# EAGLE design dustmap_lora (EAGLE 8.7.1)
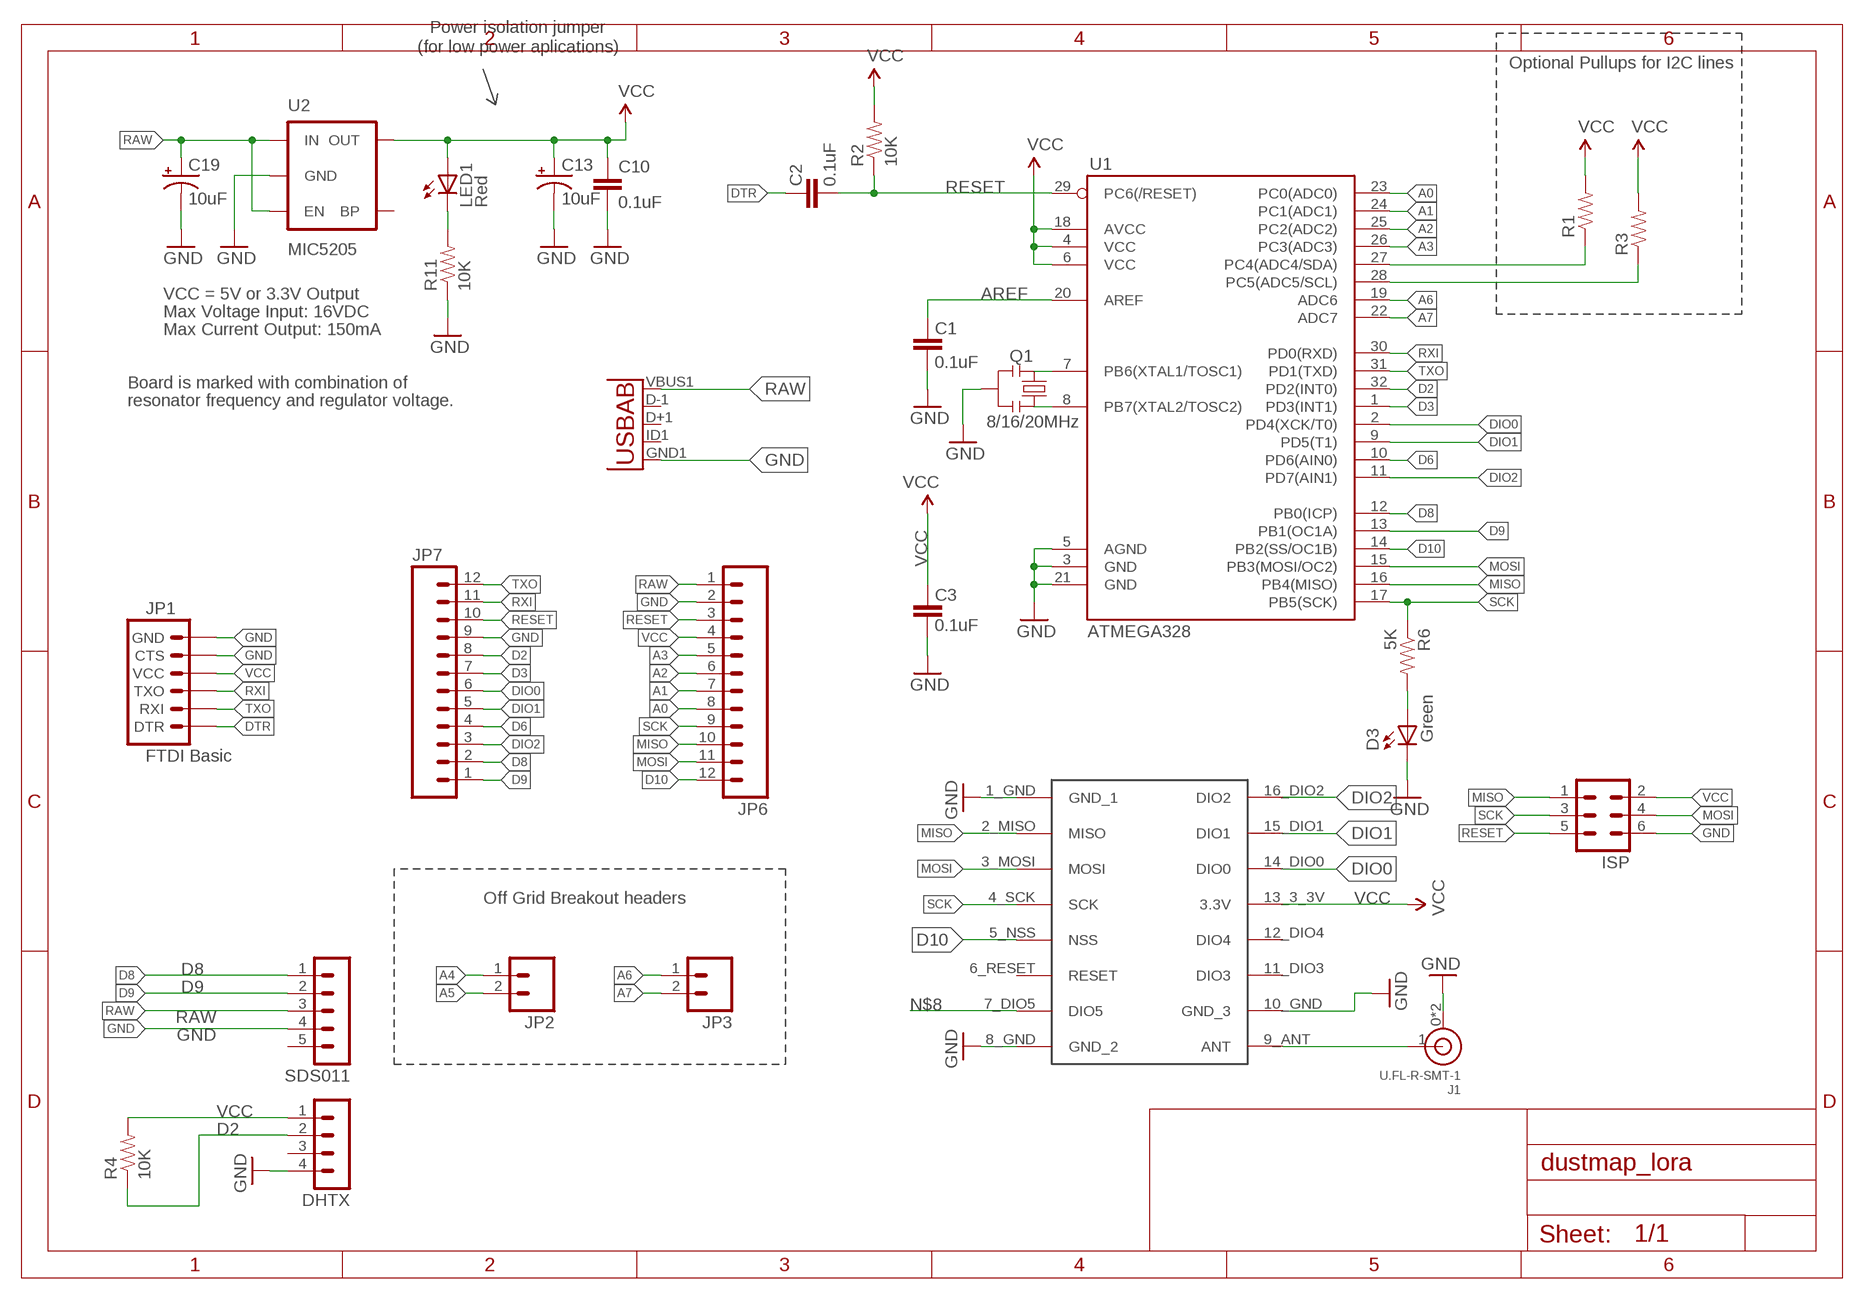
[diagram p0: schematic, sheet 1]

## Parts
C1  0.1uF  CAP0603-CAP  [0603-CAP]
C2  0.1uF  CAP0603-CAP  [0603-CAP]
C3  0.1uF  CAP0603-CAP  [0603-CAP]
C10  0.1uF  CAP0603-CAP  [0603-CAP]
C13  10uF  CAP_POL1206  [EIA3216]
C19  10uF  CAP_POL1206  [EIA3216]
D3  Green  LED  [0603-LED-ALT1]
DHTX  MA04-1  [MA04-1]
ISP  MA03-2  [MA03-2]
J1  U.FL-R-SMT-1  [U.FL]
JP1  FTDI Basic  ARDUINO_SERIAL_PROGRAMPTH  [1X06]
JP2  M02PTH  [1X02]
JP3  M02PTH  [1X02]
JP6  M12PTH  [1X12]
JP7  M12PTH  [1X12]
LED1  Red  LED  [0603-LED-ALT1]
Q1  8/16/20MHz  RESONATOR1:1  [RESONATOR-SMD-1:1]
R1  RESISTOR0603-RES  [0603-RES]
R2  10K  RESISTOR0603-RES  [0603-RES]
R3  RESISTOR0603-RES  [0603-RES]
R4  10K  RESISTOR0603-RES  [0603-RES]
R6  5K  RESISTOR0603-RES  [0603-RES]
R11  10K  RESISTOR0603-RES  [0603-RES]
SDS011  MA05-1  [MA05-1]
U1  ATMEGA328  ATMEGA168  [TQFP32-08]
U2  MIC5205  V_REG_LDOSMD  [SOT23-5]
U3  USB""  [USB-MICRO-SMD]
U$1  RF96  [SMD]

## Nets
A0: JP6.8 U1.23(PC0(ADC0))
A1: JP6.7 U1.24(PC1(ADC1))
A2: JP6.6 U1.25(PC2(ADC2))
A3: JP6.5 U1.26(PC3(ADC3))
A4: JP2.1 R1.1 U1.27(PC4(ADC4/SDA))
A5: JP2.2 R3.1 U1.28(PC5(ADC5/SCL))
A6: JP3.1 U1.19(ADC6)
A7: JP3.2 U1.22(ADC7)
AREF: C1.2 U1.20(AREF)
D2: DHTX.2 JP7.8 R4.1 U1.32(PD2(INT0))
D3: JP7.7 U1.1(PD3(INT1))
D6: JP7.4 U1.10(PD6(AIN0))
D8: JP7.2 SDS011.1 U1.12(PB0(ICP))
D9: JP7.1 SDS011.2 U1.13(PB1(OC1A))
D10: JP6.12 U1.14(PB2(SS/OC1B)) U$1.5_NSS(NSS)
DIO0: JP7.6 U1.2(PD4(XCK/T0)) U$1.14_DIO0(DIO0)
DIO1: JP7.5 U1.9(PD5(T1)) U$1.15_DIO1(DIO1)
DIO2: JP7.3 U1.11(PD7(AIN1)) U$1.16_DIO2(DIO2)
DTR: C2.2 JP1.1(DTR)
GND [vcc]: C1.1 C3.1 C10.2 C13.C(-) C19.C(-) D3.C DHTX.4 ISP.6 J1.0(GND) J1.2(GND) JP1.5(CTS) JP1.6(GND) JP6.2 JP7.9 Q1.2 R11.1 SDS011.4 U1.3(GND) U1.5(AGND) U1.21(GND) U2.2(GND) U3.GND1(GND) U$1.1_GND(GND_1) U$1.8_GND(GND_2) U$1.10_GND(GND_3)
MISO: ISP.1 JP6.10 U1.16(PB4(MISO)) U$1.2_MISO(MISO)
MOSI: ISP.4 JP6.11 U1.15(PB3(MOSI/OC2)) U$1.3_MOSI(MOSI)
N$1: Q1.3 U1.8(PB7(XTAL2/TOSC2))
N$2: Q1.1 U1.7(PB6(XTAL1/TOSC1))
N$3: J1.1(SIG) U$1.9_ANT(ANT)
N$4: LED1.C R11.2
N$7: D3.A R6.2
N$8: U$1.7_DIO5(DIO5)
RAW [vcc]: C19.A(+) JP6.1 SDS011.3 U2.1(IN) U2.3(EN) U3.VBUS1(VBUS)
RESET: C2.1 ISP.5 JP6.3 JP7.10 R2.1 U1.29(PC6(/RESET))
RXI: JP1.3(TXO) JP7.11 U1.30(PD0(RXD))
SCK: ISP.3 JP6.9 R6.1 U1.17(PB5(SCK)) U$1.4_SCK(SCK)
TXO: JP1.2(RXI) JP7.12 U1.31(PD1(TXD))
VCC: C3.2 C10.1 C13.A(+) DHTX.1 ISP.2 JP1.4(VCC) JP6.4 LED1.A R1.2 R2.2 R3.2 R4.2 U1.4(VCC) U1.6(VCC) U1.18(AVCC) U2.5(OUT) U$1.13_3_3V(3.3V)
Unconnected: DHTX.3 SDS011.5 U2.4(BP) U3.D+1(D+) U3.D-1(D-) U3.ID1(USBID) U$1.6_RESET(RESET) U$1.11_DIO3(DIO3) U$1.12_DIO4(DIO4)

## Notes on the sheet
- Power isolation jumper
- (for low power aplications)
- Optional Pullups for I2C lines
- VCC = 5V or 3.3V Output
- Max Voltage Input: 16VDC
- Max Current Output: 150mA
- Board is marked with combination of
- resonator frequency and regulator voltage.
- Off Grid Breakout headers

## Library data of the parts
C1-C3 C10 = SparkFun:CAP: Capacitor Standard 0603 ceramic capacitor, and 0.1" leaded capacitor.
C13 C19 = SparkFun:CAP_POL: Capacitor Polarized These are standard SMD and PTH capacitors. Normally 10uF, 47uF, and 100uF in electrolytic and tantalum varieties. Always verify the external diameter of the through hole cap, it varies with capacity, voltage, and manufacturer. The EIA devices should be standard.
D3 LED1 = Testing:LED: LEDs Standard schematic elements and footprints for 5mm, 3mm, 1206, and 0603 sized LEDs. 5mm - Spark Fun Electronics SKU : COM-00529 (and others)
DHTX = con-lstb:MA04-1: PIN HEADER; OC_FARNELL: unknown; OC_NEWARK: unknown
ISP = con-lstb:MA03-2: PIN HEADER; OC_FARNELL: unknown; OC_NEWARK: unknown
J1 = J:U.FL-R-SMT-1: U.FL SMD antenna connector Source: https://www.hirose-connectors.com/connectors/H204ProductListSearch.aspx?sn=U.FL&cat=03
JP1 = SparkFun:ARDUINO_SERIAL_PROGRAM
JP2 JP3 = SparkFun:M02: Header 2 Standard 2-pin 0.1" header. Use with straight break away headers (SKU : PRT-00116), right angle break away headers (PRT-00553), swiss pins (PRT-00743), machine pins (PRT-00117), and female headers (PRT-00115). Molex polarized connector foot print use with SKU : PRT-08233 with associated crimp pins and housings.
JP6 JP7 = SparkFun:M12: Header 12 Standard 12-pin 0.1" header. Use with straight break away headers (SKU : PRT-00116), right angle break away headers (PRT-00553), swiss pins (PRT-00743), machine pins (PRT-00117), and female headers (PRT-00115).
Q1 = Testing:RESONATOR: Resonator Small SMD resonator. This is the itty bitty 10/20MHz resonators with built in caps. CSTCE10M0G55 and CSTCE20M0V53. Footprint for SMD has been used in SFE production for years, and does work okay. 1:1 is an attempt to get larger fillets on the sides so it will be easier to inspect these solders in our AOI machine. The pads have been minimized to match the actual metal under the resonator. To see this relation, it includes an image import of the bottom side of the component. Imported to scale on layer 200.
R1-R4 R6 R11 = SparkFun:RESISTOR: Resistor Basic schematic elements and footprints for 0603, 1206, and PTH resistors.
SDS011 = con-lstb:MA05-1: PIN HEADER; OC_FARNELL: unknown; OC_NEWARK: unknown
U1 = SparkFun:ATMEGA168
U2 = SparkFun:V_REG_LDO: Voltage Regulator LDO Standard 150mA LDO voltage regulator in SOT-23 layout. Micrel part MIC5205. BP (by-pass) pin is used to lower output noise with 470pF cap.
U3 = MicroUSB:USB: This is a USB AB connector that is compatible with USB OTG. i.e. this connector can serve as a host or device
U$1 = dustmap:RF96

## Net classes
0 default: width 0.203 mm
1 vcc: width 0.254 mm

## Board
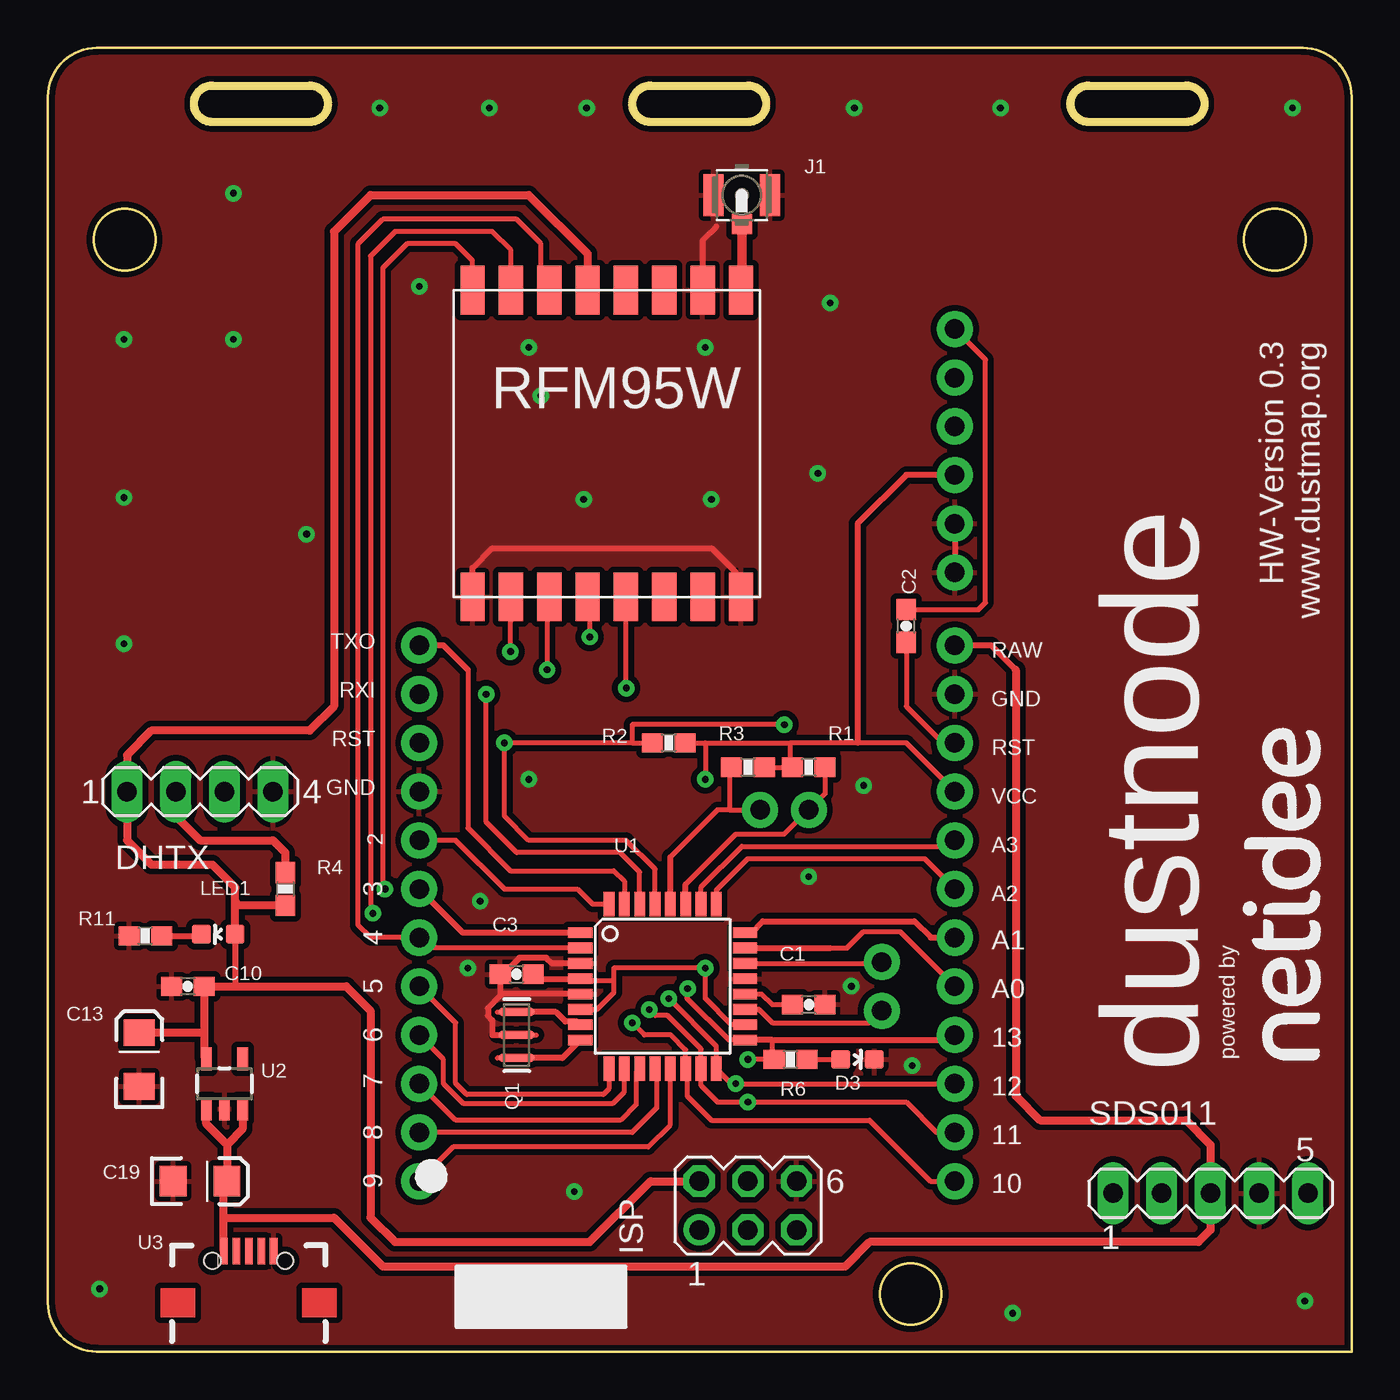
[diagram p1: board, top side]
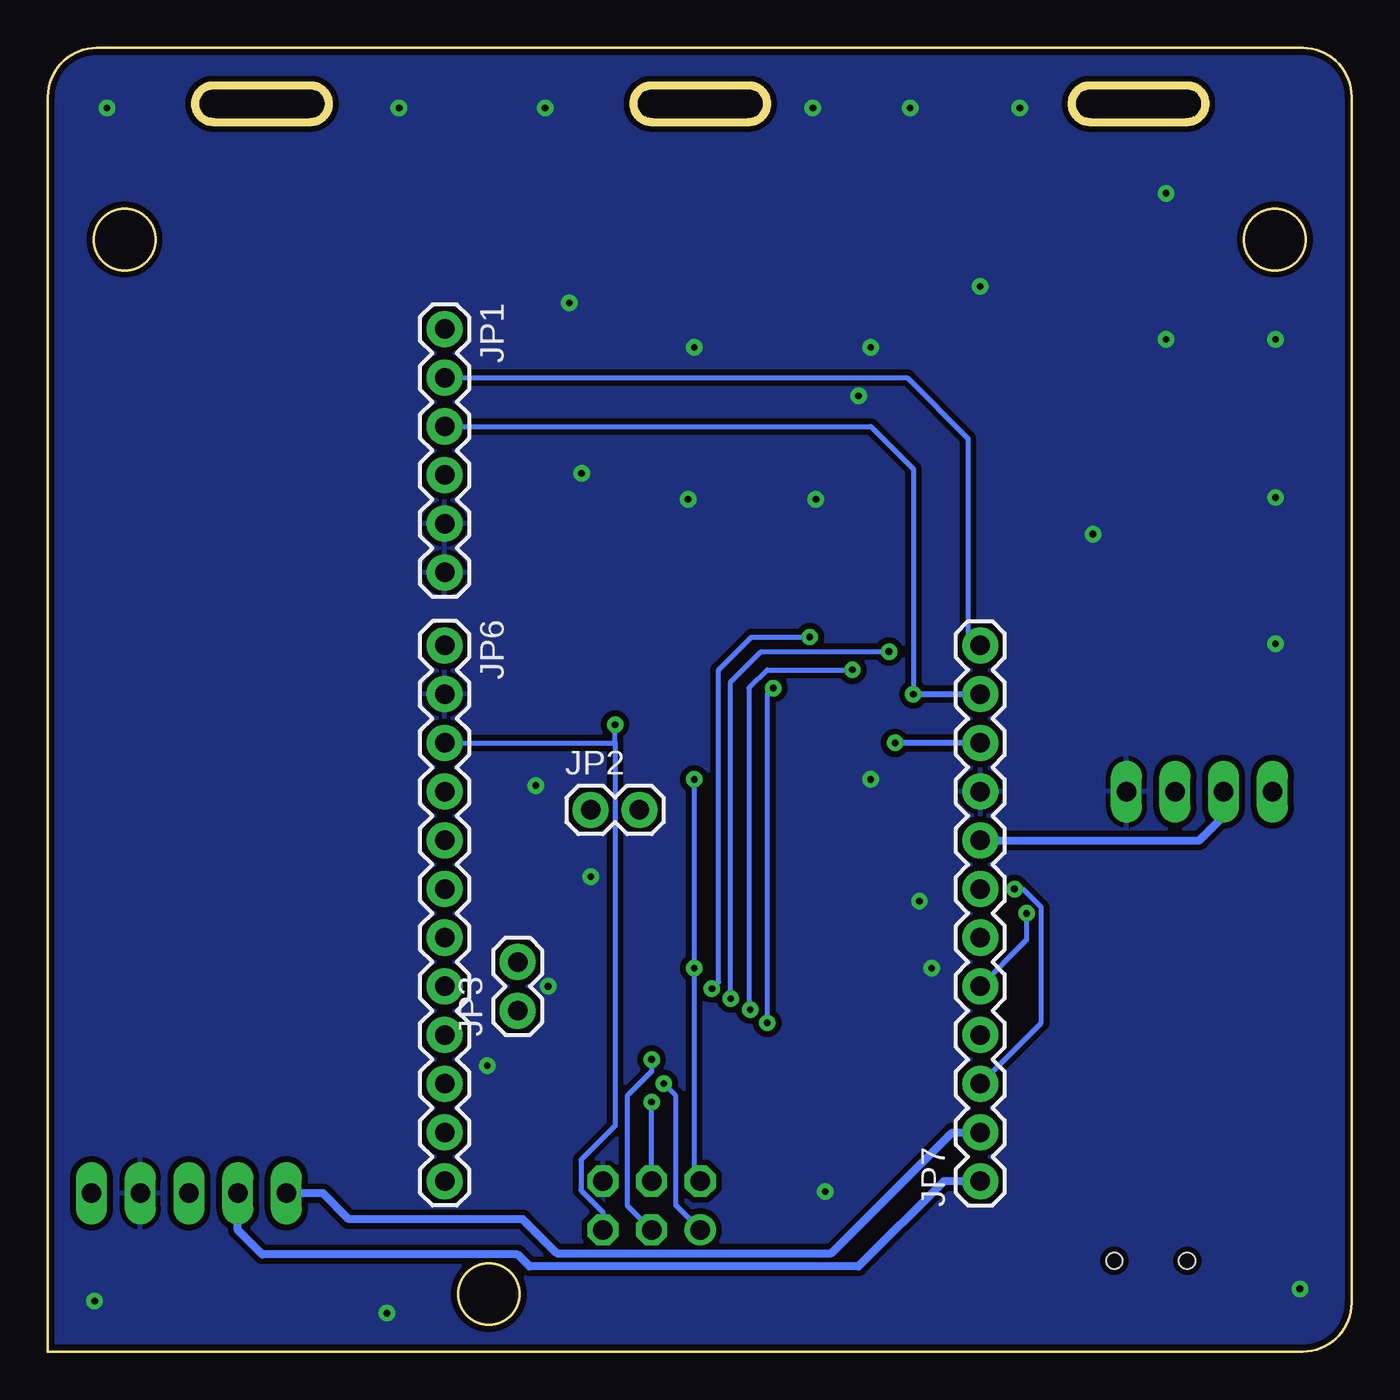
[diagram p2: board, bottom side, seen from below]

Size 68 x 68 mm. Coordinates in mm from the lower left corner, seen from the top.
Outline: 8.57,66.04 13.65,66.04 arc-180 13.65,64.14 8.57,64.14 arc-180 8.57,66.04
Outline: 54.29,66.04 59.37,66.04 arc-180 59.37,64.14 54.29,64.14 arc-180 54.29,66.04
Outline: 31.43,66.04 36.51,66.04 arc-180 36.51,64.14 31.43,64.14 arc-180 31.43,66.04
Copper layers (1*16): Top 0.035mm / dielectric 1.5mm / Bottom 0.035mm
Design rules "SparkFun-2-layer *": minimum track width 7mil, minimum drill 15mil, track to track 8mil, track to pad 8mil, pad to pad 8mil, via to via 8mil, smd to smd 8mil, copper to edge 8mil, drill to drill 8mil, minimum pad ring 12mil, minimum via ring 10mil, stop-mask expansion 4mil, vias tented up to drill 20mil, thermal gap 10mil

### Footprints (pad centres in the part's own frame; a part is rotated, then mirrored left to right if it is on the bottom)
0603-CAP = smd 1.1 x 1: 1 -0.85,0; 2 0.85,0
EIA3216 = smd 1.4 x 1.6: A 1.4,0; C -1.4,0
0603-LED-ALT1 = smd 1 x 1: A 0,-0.877; C 0,0.877
MA04-1 = drill 1.016 long: 1 -3.81,0; 2 -1.27,0; 3 1.27,0; 4 3.81,0
MA03-2 = drill 1.016: 1 -2.54,-1.27 | drill 1.016 octagon: 2 -2.54,1.27; 3 0,-1.27; 4 0,1.27; 5 2.54,-1.27; 6 2.54,1.27
U.FL = smd 1.05 x 2.2: 0 -1.475,0; 2 1.475,0 | smd 1.05 x 1.05: 1 0,-1.525
1X06 = drill 1.016 pad 1.88: 1 0,0; 2 2.54,0; 3 5.08,0; 4 7.62,0; 5 10.16,0; 6 12.7,0
1X02 = drill 1.016 pad 1.88: 1 0,0; 2 2.54,0
1X12 = drill 1.016 pad 1.88: 1 0,0; 2 2.54,0; 3 5.08,0; 4 7.62,0; 5 10.16,0; 6 12.7,0; 7 15.24,0; 8 17.78,0; 9 20.32,0; 10 22.86,0; 11 25.4,0; 12 27.94,0
RESONATOR-SMD-1:1 = smd 0.45 x 1.905: 1 -1.2,0; 2 0,0; 3 1.2,0
0603-RES = smd 1.1 x 1: 1 -0.85,0; 2 0.85,0
MA05-1 = drill 1.016 long: 1 -5.08,0; 2 -2.54,0; 3 0,0; 4 2.54,0; 5 5.08,0
TQFP32-08 = smd 1.27 x 0.559: 1 -4.293,2.8; 2 -4.293,2; 3 -4.293,1.2; 4 -4.293,0.4; 5 -4.293,-0.4; 6 -4.293,-1.2; 7 -4.293,-2; 8 -4.293,-2.8; 17 4.293,-2.8; 18 4.293,-2; 19 4.293,-1.2; 20 4.293,-0.4; 21 4.293,0.4; 22 4.293,1.2; 23 4.293,2; 24 4.293,2.8 | smd 0.559 x 1.27: 9 -2.8,-4.293; 10 -2,-4.293; 11 -1.2,-4.293; 12 -0.4,-4.293; 13 0.4,-4.293; 14 1.2,-4.293; 15 2,-4.293; 16 2.8,-4.293; 25 2.8,4.293; 26 2,4.293; 27 1.2,4.293; 28 0.4,4.293; 29 -0.4,4.293; 30 -1.2,4.293; 31 -2,4.293; 32 -2.8,4.293
SOT23-5 = smd 0.55 x 1.2: 1 -0.95,-1.3; 2 0,-1.3; 3 0.95,-1.3; 4 0.95,1.3; 5 -0.95,1.3
USB-MICRO-SMD = smd 1.4 x 0.4: D+1 2.7,0; D-1 2.7,0.65; GND1 2.7,-1.3; ID1 2.7,-0.65; VBUS1 2.7,1.3 | hole 0.85: 2.2,1.9; 2.2,-1.9
SMD = smd 2.54 x 1.27: 1_GND 0,15; 2_MISO 0,13; 3_MOSI 0,11; 4_SCK 0,9; 5_NSS 0,7; 6_RESET 0,5; 7_DIO5 0,3; 8_GND 0,1; 9_ANT 16,1; 10_GND 16,3; 11_DIO3 16,5; 12_DIO4 16,7; 13_3_3V 16,9; 14_DIO0 16,11; 15_DIO1 16,13; 16_DIO2 16,15

### Placement (x,y rotation side)
C1  39.69,18.1 180 top
C2  44.77,37.85 90 top
C3  24.45,19.68 0 top
C10  7.3,19.05 180 top
C13  4.76,15.24 90 top
C19  7.94,8.89 0 top
D3  42.23,15.24 270 top
DHTX  7.94,29.21 0 top
ISP  36.51,7.62 0 top
J1  36.2,60.33 0 top
JP1  47.31,53.34 270 bottom
JP2  39.69,28.26 0 bottom
JP3  43.5,17.78 90 bottom
JP6  47.31,36.83 270 bottom
JP7  19.37,8.89 90 bottom
LED1  8.89,21.77 90 top
Q1  24.45,16.51 270 top
R1  39.69,30.48 180 top
R2  32.39,31.75 0 top
R3  36.51,30.48 0 top
R4  12.38,24.13 270 top
R6  38.73,15.24 0 top
R11  5.08,21.68 0 top
SDS011  60.64,8.26 0 top
U1  32.07,19.05 0 top
U2  9.21,13.97 0 top
U3  10.48,2.54 90 top
U$1  37.15,39.37 90 top
U$2  [SDS011]  0,0 0 top

### Tracks (layer width: path | path; a pad name or v marks a point on that pad's centre or on a via)
A0
  Top 0.254: 40.81,21.05 41.69,21.05 42.54,21.91 44.45,21.91 JP6.8
  Top 0.305: U1.23 40.81,21.05
A1
  Top 0.305: JP6.7 46.05,21.59 45.2,22.44 37.28,22.44 36.69,21.85 U1.24
A2
  Top 0.254: U1.25 34.87,24.07 36.51,25.72 45.72,25.72 JP6.6
A3
  Top 0.254: U1.26 34.07,24.23 36.19,26.35 46.99,26.35 JP6.5
A4
  Top 0.254: 33.27,24.38 35.88,26.99 38.42,26.99 JP2.1 40.54,29.11 R1.1
  Top 0.305: U1.27 33.27,24.38
A5
  Top 0.254: 32.47,25.8 34.93,28.26 35.56,28.26 | 35.56,28.26 JP2.2 | R3.1 35.56,30.38 35.56,28.26
  Top 0.305: U1.28 32.47,25.8
A6
  Top 0.254: U1.19 37.08,17.85 37.78,17.14 42.86,17.14 JP3.1
A7
  Top 0.254: U1.22 43.43,20.25 JP3.2
AREF
  Top 0.254: U1.20 37.23,18.65 37.78,18.1 C1.2
D2
  Top 0.254: 29.21,23.4 U1.32 28.41,23.34 27.62,24.13 23.81,24.13 21.27,26.67 JP7.8
  Top 0.406: DHTX.2 6.67,27.94 7.94,26.67 11.75,26.67 12.38,26.04 R4.1
  Bottom 0.406: DHTX.2 6.67,27.94 7.94,26.67 JP7.8
D3
  Top 0.305: U1.1 21.65,21.85 JP7.7
D6
  Top 0.254: 30.07,14.2 U1.10 30.07,13.56 29.46,12.95 21.65,12.95 20.64,13.97 20.64,15.24 JP7.4
D8
  Top 0.254: U1.12 31.75,14.68 31.75,12.7 30.48,11.43 JP7.2
  Bottom 0.406: SDS011.1 53.66,8.26 52.31,6.91 43.24,6.91 41.46,5.13 27.12,5.13 20.82,11.43 JP7.2
D9
  Top 0.254: 32.39,14.84 U1.13 32.47,11.83 31.31,10.67 21.15,10.67 JP7.1
  Bottom 0.406: JP7.1 21.27,8.89 25.72,4.45 42.88,4.45 43.51,5.07 56.82,5.07 58.1,6.35 SDS011.2
D10  (via drill 0.35, 0.35 pad 0.55)
  Top 0.254: JP6.12 46.04,8.89 42.86,12.06 34.61,12.06 33.34,13.34 33.34,14.69 U1.14 33.27,15.75 32.51,16.51 31.11,16.51 v30.48,17.14 | v30.16,34.61 30.16,39.35 U$1.5_NSS
  Bottom 0.254: v30.16,34.61 30.48,34.29 v30.48,17.14
DIO0
  Top 0.254: U1.2 19.91,21.05 JP7.6 16.83,21.59 16.19,22.23 16.19,57.78 17.46,59.05 24.45,59.05 25.72,57.78 25.72,55.8 U$1.14_DIO0
DIO1  (via drill 0.35)
  Top 0.254: U$1.15_DIO1 24.15,57.45 23.18,58.42 18.1,58.42 16.83,57.15 16.83,22.86 v16.95,22.86 | U1.9 29.27,13.71 28.97,13.41 21.84,13.41 21.27,13.98 21.27,17.14 JP7.5
  Bottom 0.254: v16.95,22.86 16.95,21.47 JP7.5
DIO2  (via drill 0.35)
  Top 0.254: U$1.16_DIO2 22.15,56.91 21.27,57.78 18.73,57.78 17.46,56.52 17.46,24.25 v17.59,24.13 | U1.11 30.68,14.57 30.68,12.89 29.86,12.06 21.27,12.06 JP7.3
  Bottom 0.254: JP7.3 16.19,17.14 16.19,23.17 17.15,24.13 v17.59,24.13
DTR
  Top 0.254: JP1.1 48.91,51.74 48.91,39.06 48.54,38.7 C2.2
GND  (via drill 0.35 pad 0.55)
  Top 0.305: U$1.10_GND 34.15,57.96 34.87,58.68 | Q1.2 23.18,16.51 23.18,17.28 22.95,17.51 22.95,17.91 23.6,18.56 | U$1.1_GND 22.15,40.88 23.18,41.91 34.61,41.91 35.88,40.64 35.88,39.64 U$1.8_GND | JP1.5 JP1.6 | 23.6,18.56 C3.1 23.74,19.68 24.6,20.54 25.99,20.54 26.29,20.25 U1.3 | U1.5 23.69,18.65 23.6,18.56
  other vias: 25.08,29.84 22.54,23.5 21.91,20 45.09,14.92 41.91,19.05 39.69,24.77 42.55,29.53 27.94,44.45 34.61,44.45 34.29,52.39 25.08,52.39 25.72,49.85 40.16,45.81 3.97,52.8 3.97,44.55 3.97,36.92 9.68,52.8 9.68,60.42 17.3,64.86 23.02,64.86 28.1,64.86 64.93,64.86 42.07,64.86 49.69,64.86 65.56,2.63 50.32,2 40.8,54.7 13.49,42.64 2.7,3.27 27.46,8.35 19.37,55.56
  pour Top (isolate 0.305): 0.32,67.65 67.88,67.65 67.88,0 0.32,0
  pour Bottom (isolate 0.305): 0.32,67.65 67.88,67.65 67.88,0 0.32,0
MISO  (via drill 0.35, 0.35 pad 0.55)
  Top 0.254: JP6.10 v35.88,13.97 35.65,13.97 U1.16 34.87,15.93 v32.39,18.41 | U$1.2_MISO 24.15,38.08 24.13,38.06 v24.13,36.51
  Bottom 0.254: v32.39,18.41 32.39,34.92 30.8,36.51 v24.13,36.51 | ISP.1 35.24,7.62 35.24,13.34 v35.88,13.97
MOSI  (via drill 0.35, 0.35 pad 0.55)
  Top 0.254: JP6.11 46.36,11.43 44.77,13.02 v36.51,13.02 34.93,13.02 34.07,13.88 U1.15 34.07,15.78 32.32,17.52 31.69,17.52 v31.37,17.84 | U$1.3_MOSI 26.04,39.26 v26.04,35.56
  Bottom 0.254: v26.04,35.56 30.48,35.56 31.43,34.61 31.43,17.9 v31.37,17.84 | ISP.4 v36.51,13.02
N$1
  Top 0.305: U1.8 26.83,15.31 Q1.3
N$2
  Top 0.305: U1.7 27.61,17.21 26.99,17.21 26.5,17.71 Q1.1
N$3
  Top 0.254: 36.19,55.42 U$1.9_ANT
  Top 0.508: J1.1 36.19,55.42
N$4
  Top 0.305: R11.2 7.93,21.68 LED1.C
N$7
  Top 0.254: R6.2 D3.A
RAW
  Top 0.305: 50.48,35.56 49.21,36.83 JP6.1 | 9.18,8.73 C19.A
  Top 0.406: U3.VBUS1 9.18,6.99 | 9.18,6.99 9.18,8.73 | 9.34,10.79 C19.A | U2.3 10.16,11.62 9.34,10.79 | 9.34,10.79 8.26,11.88 U2.1 | 9.18,6.99 14.92,6.99 17.46,4.45 41.59,4.45 42.86,5.71 60.01,5.71 60.64,6.35 SDS011.3 60.64,10.79 59.37,12.06 51.75,12.06 50.48,13.34 50.48,35.56
RESET  (via drill 0.35)
  Top 0.254: U1.29 31.67,25.16 30.16,26.67 25.08,26.67 23.81,27.94 v23.81,31.75 30.48,31.75 | C2.1 44.77,33.66 46.67,31.75 JP6.3 | 30.48,31.75 R2.1 | v38.42,32.7 30.48,32.7 30.48,31.75
  Bottom 0.254: JP6.3 38.42,31.75 | 38.42,31.75 38.42,11.78 40.2,10 40.2,8.42 39.05,7.27 ISP.5 | 38.42,31.75 v38.42,32.7
  Bottom 0.305: JP7.10 v23.81,31.75
RXI  (via drill 0.35)
  Top 0.254: U1.30 30.87,25.01 29.84,26.04 24.45,26.04 22.86,27.62 v22.86,34.29
  Bottom 0.254: JP1.3 25.08,48.26 22.86,46.04 v22.86,34.29
  Bottom 0.305: v22.86,34.29 JP7.11
SCK  (via drill 0.35, 0.35 pad 0.55)
  Top 0.254: 37.78,16.25 37.78,15.34 R6.1 v36.51,15.24 | U1.17 35.51,16.25 33.34,18.42 33.34,18.92 v33.36,18.94 | U$1.4_SCK 28.26,39.26 v28.26,37.27
  Top 0.305: U1.17 37.78,16.25 47.05,16.25 JP6.9
  Bottom 0.254: v33.36,18.94 33.02,19.28 33.02,35.56 31.31,37.27 v28.26,37.27 | v36.51,15.24 36.51,14.61 37.78,13.34 37.78,7.62 ISP.3
TXO
  Top 0.254: 21.91,35.56 21.91,27.3 24.13,25.08 29.53,25.08 30.07,24.54 U1.31
  Top 0.305: 21.91,35.56 20.64,36.83 JP7.12
  Bottom 0.254: JP1.2 23.18,50.8 20,47.62 20,37.47 JP7.12
VCC  (via drill 0.35 pad 0.55)
  Top 0.254: R3.2 R1.2 38.73,30.58 38.73,31.75 | U1.4 27.86,19.37 29.53,19.37 | U1.6 28.65,17.85 29.53,18.73 29.53,19.37 | 34.29,31.75 38.73,31.75 | 34.29,31.75 v34.29,29.84 | 29.53,19.37 29.53,20 v34.29,20 34.29,18.41 35.65,17.05 U1.18 | JP6.4 44.77,31.75 42.23,31.75 38.73,31.75 | R2.2 34.29,31.75
  Top 0.305: U1.4 25.53,19.45 C3.2 | 8.15,15.38 U2.5 | 8.02,16.64 8.15,16.51 | LED1.A 9.77,19.12 9.84,19.05 | JP1.4 44.77,45.72 42.23,43.18 42.23,31.75
  Top 0.406: 8.15,15.38 8.15,16.51 C10.1 9.84,19.05 15.56,19.05 16.83,17.78 16.83,6.99 18.1,5.71 28.26,5.71 31.43,8.89 ISP.2 | C13.A 8.02,16.64 | LED1.A 9.77,23.5 | 9.77,23.5 9.77,24.21 8.57,25.4 5.4,25.4 4.13,26.67 DHTX.1 4.13,31.11 5.4,32.38 13.65,32.38 14.92,33.66 14.92,58.42 16.83,60.33 25.08,60.33 28.15,57.26 U$1.13_3_3V | R4.2 9.98,23.28 9.77,23.5
  Bottom 0.254: v34.29,29.84 v34.29,20 34.29,9.21 ISP.2

### Text on the board
tPlace: TXO | RAW | RXI | GND | RST | RST | GND | VCC | 2 | A3 | 3 | A2 | 4 | A1 | 5 | A0 | 6 | 13 | 7 | 12 | 8 | 11 | 9 | 10
tNames: HW-Version 0.3 | www.dustmap.org | dustnode | powered by